# EAGLE schematic analog_input (EAGLE 7.1.0)
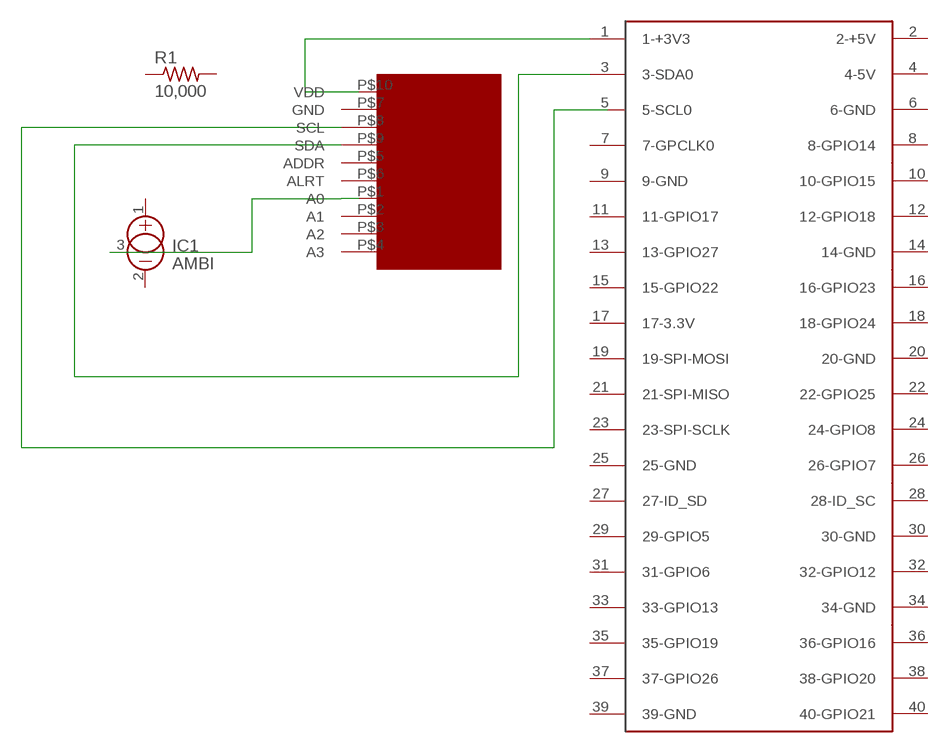
[diagram p0: schematic, sheet 1]

## Parts
IC1  AMBI  AD590H  [TO18]
R1  10,000  R-US_0204/2V  [0204V]
U$1  RASPBERRY-PI  [RASPBERRY-PI]
U$2  ADS1015  [ADS1015]

## Nets
N$1: U$1.1(1-+3V3)
N$2: IC1.3(CAN)
N$4: U$1.3(3-SDA0)
Unconnected: IC1.1(+) IC1.2(-) R1.1 R1.2 U$1.2(2-+5V) U$1.4(4-5V) U$1.5(5-SCL0) U$1.6(6-GND) U$1.7(7-GPCLK0) U$1.8(8-GPIO14) U$1.9(9-GND) U$1.10(10-GPIO15) U$1.11(11-GPIO17) U$1.12(12-GPIO18) U$1.13(13-GPIO27) U$1.14(14-GND) U$1.15(15-GPIO22) U$1.16(16-GPIO23) U$1.17(17-3.3V) U$1.18(18-GPIO24) U$1.19(19-SPI-MOSI) U$1.20(20-GND) U$1.21(21-SPI-MISO) U$1.22(22-GPIO25) U$1.23(23-SPI-SCLK) U$1.24(24-GPIO8) U$1.25(25-GND) U$1.26(26-GPIO7) U$1.27(27-ID_SD) U$1.28(28-ID_SC) U$1.29(29-GPIO5) U$1.30(30-GND) U$1.31(31-GPIO6) U$1.32(32-GPIO12) U$1.33(33-GPIO13) U$1.34(34-GND) U$1.35(35-GPIO19) U$1.36(36-GPIO16) U$1.37(37-GPIO26) U$1.38(38-GPIO20) U$1.39(39-GND) U$1.40(40-GPIO21) U$2.P$1(A0) U$2.P$2(A1) U$2.P$3(A2) U$2.P$4(A3) U$2.P$5(ADDR) U$2.P$6(ALRT) U$2.P$7(GND) U$2.P$8(SCL) U$2.P$9(SDA) U$2.P$10(VDD)

## Library data of the parts
IC1 = linear:AD590H: TEMPERATURE SENSOR current output
R1 = adafruit:R-US_: RESISTOR, American symbol
U$1 = aliEagleLib:RASPBERRY-PI: Raspberry Pi Board <http://www.raspberrypi.org/> Jacques Lagnel V1.0 (beta) 2012 Board dimension: Forum 3D model <http://www.raspberrypi.org/forum/general-discussion/mechanical-profile-3d-models?value=3d%20model&type=1&include=1&search=1&ret=all> The GPIO Connector (P1): http://elinux.org/RPi_Low-level_peripherals
U$2 = ads1015:ADS1015